# EAGLE design 808 (EAGLE 6.4)
DATABASE: ../partsdb.txt
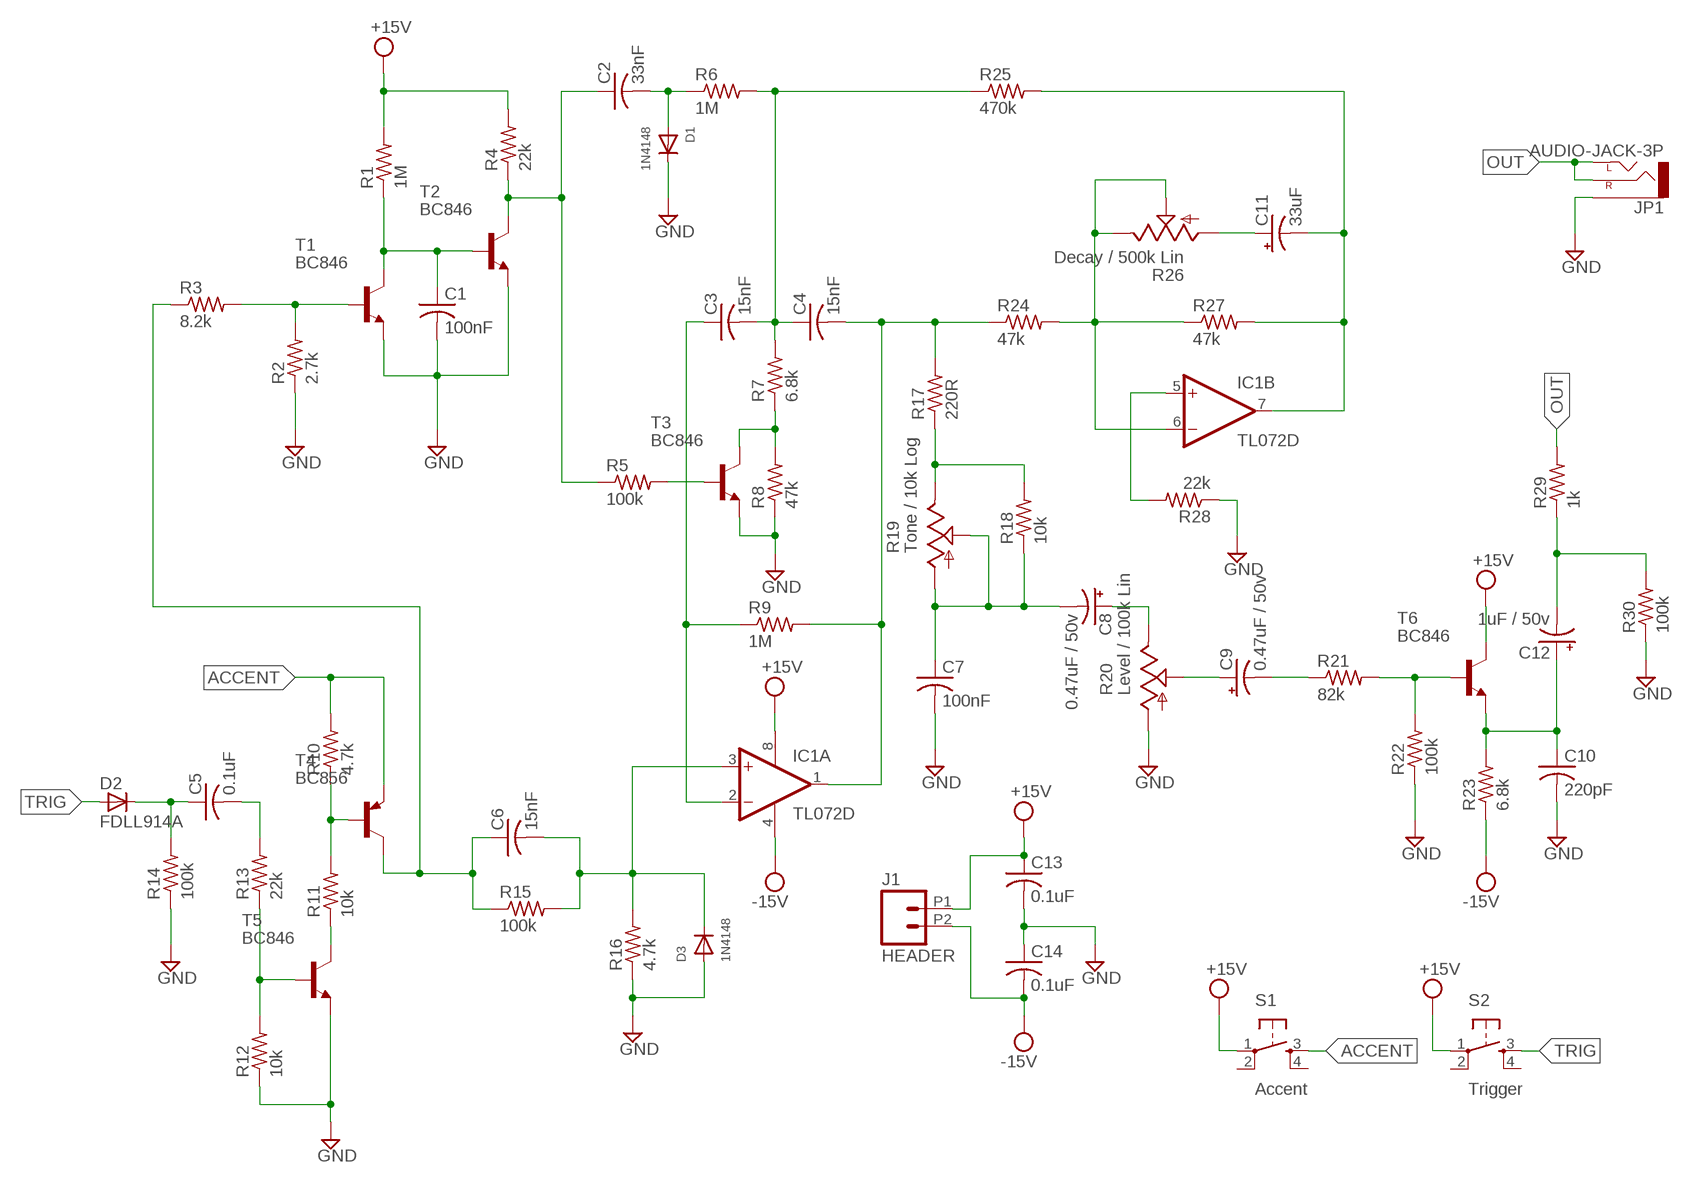
[diagram p0: schematic, sheet 1]

## Parts
C1  100nF  C-USC0805  [C0805]
C2  33nF  C-USC0805  [C0805]
C3  15nF  C-USC0805  [C0805]
C4  15nF  C-USC0805  [C0805]
C5  0.1uF  C-USC0805  [C0805]
C6  15nF  C-USC0805  [C0805]
C7  100nF  C-USC0805  [C0805]
C8  0.47uF / 50v  CAP-POLPANASONIC_B-2  [PANASONIC_VS_B-2]
C9  0.47uF / 50v  CAP-POLPANASONIC_B-2  [PANASONIC_VS_B-2]
C10  220pF  C-USC0805  [C0805]
C11  33uF  CAP-POLPANASONIC_B-2  [PANASONIC_VS_B-2]
C12  1uF / 50v  CAP-POLPANASONIC_B-2  [PANASONIC_VS_B-2]
C13  0.1uF  C-USC0805  [C0805]
C14  0.1uF  C-USC0805  [C0805]
D1  1N4148  DIODESOD-323F  [SOD-323F]
D2  FDLL914A  D-MLL-34  [MELF-MLL34]
D3  1N4148  DIODESOD-323F  [SOD-323F]
IC1  TL072D  [SO08]
J1  HEADER  [1X02-5.08-SCREWTERM]
JP1  AUDIO-JACK-3P  [CUI-352X-SMT]
R1  1M  R-US_R0805  [R0805]
R2  2.7k  R-US_R0805  [R0805]
R3  8.2k  R-US_R0805  [R0805]
R4  22k  R-US_R0805  [R0805]
R5  100k  R-US_R0805  [R0805]
R6  1M  R-US_R0805  [R0805]
R7  6.8k  R-US_R0805  [R0805]
R8  47k  R-US_R0805  [R0805]
R9  1M  R-US_R0805  [R0805]
R10  4.7k  R-US_R0805  [R0805]
R11  10k  R-US_R0805  [R0805]
R12  10k  R-US_R0805  [R0805]
R13  22k  R-US_R0805  [R0805]
R14  100k  R-US_R0805  [R0805]
R15  100k  R-US_R0805  [R0805]
R16  4.7k  R-US_R0805  [R0805]
R17  220R  R-US_R0805  [R0805]
R18  10k  R-US_R0805  [R0805]
R19  Tone / 10k Log  POTPTV09-H  [POTENTIOMETER-PTV09]
R20  Level / 100k Lin  POTCTS296  [POTENTIOMETER-CTS296]
R21  82k  R-US_R0805  [R0805]
R22  100k  R-US_R0805  [R0805]
R23  6.8k  R-US_R0805  [R0805]
R24  47k  R-US_R0805  [R0805]
R25  470k  R-US_R0805  [R0805]
R26  Decay / 500k Lin  POTPTV09-H  [POTENTIOMETER-PTV09]
R27  47k  R-US_R0805  [R0805]
R28  22k  R-US_R0805  [R0805]
R29  1k  R-US_R0805  [R0805]
R30  100k  R-US_R0805  [R0805]
S1  Accent  TAC_SWITCHSMD  [TACTILE-SWITCH-SMD]
S2  Trigger  TAC_SWITCHSMD  [TACTILE-SWITCH-SMD]
T1  BC846  [SOT23]
T2  BC846  [SOT23]
T3  BC846  [SOT23]
T4  BC856  BC856B-PNP-SOT23-BEC  [SOT23-BEC]
T5  BC846  [SOT23]
T6  BC846  [SOT23]

## Nets
+15V: C13.1 IC1.8(P:V+) J1.P1 R1.2 R4.2 S1.1 S2.1 T6.3(C)
-15V: C14.2 IC1.4(P:V-) J1.P2 R23.1
ACCENT: R10.2 S1.3 T4.E
GND: C1.2 C7.2 C10.2 C13.2 C14.1 D1.C D3.A JP1.1(SLEEVE) R2.1 R8.1 R12.1 R14.1 R16.1 R20.P$1(A) R22.1 R28.1 R30.1 T1.2(E) T2.2(E) T3.2(E) T5.2(E)
N$1: C1.1 R1.1 T1.3(C) T2.1(B)
N$2: C3.1 IC1.2(A:-IN) R9.1
N$3: C2.1 R4.1 R5.1 T2.3(C)
N$4: R2.2 R3.2 T1.1(B)
N$5: C2.2 D1.A R6.1
N$6: R5.2 T3.1(B)
N$7: R7.1 R8.2 T3.3(C)
N$8: C4.2 IC1.1(A:OUT) R9.2 R17.2 R24.1
N$9: C3.2 C4.1 R6.2 R7.2 R25.1
N$10: C6.1 R3.1 R15.1 T4.C
N$11: R11.1 T5.3(C)
N$12: R10.1 R11.2 T4.B
N$13: R12.2 R13.1 T5.1(B)
N$14: C5.2 R13.2
N$15: C5.1 D2.1(C) R14.2
N$16: C6.2 D3.C IC1.3(A:+IN) R15.2 R16.2
N$17: R17.1 R18.2 R19.P$3(E)
N$18: C7.1 C8.- R18.1 R19.P$1(A) R19.P$2(S)
N$19: IC1.6(B:-IN) R24.2 R26.P$2(S) R26.P$3(E) R27.1
N$20: C8.+ R20.P$3(E)
N$21: C9.+ R20.P$2(S)
N$22: C9.- R21.1
N$23: R21.2 R22.2 T6.1(B)
N$24: C10.1 C12.+ R23.2 T6.2(E)
N$25: IC1.5(B:+IN) R28.2
N$26: C11.- IC1.7(B:OUT) R25.2 R27.2
N$27: C11.+ R26.P$1(A)
N$28: C12.- R29.1 R30.2
OUT: JP1.2(LEFT) JP1.3(RIGHT) R29.2
TRIG: D2.2(A) S2.3
Unconnected: S1.2 S1.4 S2.2 S2.4

## Library data of the parts
C1 C5 C7 C13 C14 = adafruit:C-US: CAPACITOR, American symbol; PARTNO: C0805C104K5RACTU
C2 = adafruit:C-US: CAPACITOR, American symbol; PARTNO: CL21B333KBANNNC
C3 C4 C6 = adafruit:C-US: CAPACITOR, American symbol; PARTNO: CC0805KRX7R9BB153
C8 C9 = Livestream:CAP-POL; PARTNO: EEE-1HAR47AR
C10 = adafruit:C-US: CAPACITOR, American symbol; PARTNO: CC0805KRX7R9BB221
C11 = Livestream:CAP-POL; PARTNO: EEE-1AA330WAR
C12 = Livestream:CAP-POL; PARTNO: EEE-1HA010SR
D1 D3 = adafruit:DIODE: Diode SMADIODE - SMA Surface Mount Package 20V 1A Schottky Diode Digikey: 641-1014-6-ND DO-1N4148 - Through Hole Small Current Diode SOD-123 20V 1 A (.5mV Vf) Schottky Diode - Digikey: MBRX120TPMSCT-ND SOD-323 10V 570mA (.38mV Vf, 3ns) Schottky Diode - Digikey: ZLLS410CT-ND SOD-523 30V 30mA Schottky Diode (RB751S-40TE61) - Digikey: RB751S-40TE61CT-ND SOT23-R/W - SOT23 Package (R = Solder Paste/Reflow Ovens, W = Hand-Soldering) BAT54Film 40V 300mA - Digikey: 497-7162-1-ND; PARTNO: 1N4148WS
D2 = semicon-smd-ipc:D-: DIODE unfilled; PARTNO: FDLL914A
IC1 = linear:TL072: OP AMP; PARTNO: TL072SG-13
J1 = Livestream:HEADER
JP1 = Livestream:AUDIO-JACK-3P; PARTNO: SJ-3523-SMT-TR
R1 R6 R9 = adafruit:R-US_: RESISTOR, American symbol; PARTNO: RC2012F105CS
R2 = adafruit:R-US_: RESISTOR, American symbol; PARTNO: RMCF0805JT2K70
R3 = adafruit:R-US_: RESISTOR, American symbol; PARTNO: RMCF0805JT8K20
R4 R13 R28 = adafruit:R-US_: RESISTOR, American symbol; PARTNO: RMCF0805JT22K0
R5 R14 R15 R22 R30 = adafruit:R-US_: RESISTOR, American symbol; PARTNO: RC2012J104CS
R7 R23 = adafruit:R-US_: RESISTOR, American symbol; PARTNO: MCR10ERTF6801
R8 R24 R27 = adafruit:R-US_: RESISTOR, American symbol; PARTNO: RMCF0805JT47K0
R10 R16 = adafruit:R-US_: RESISTOR, American symbol; PARTNO: RMCF0805JT4K70
R11 R12 R18 = adafruit:R-US_: RESISTOR, American symbol; PARTNO: RC2012J103CS
R17 = adafruit:R-US_: RESISTOR, American symbol; PARTNO: RMCF0805JT220R
R19 = 808:POT; PARTNO: PTV09A-4020F-A103
R20 = 808:POT; PARTNO: 296UD104B1N
R21 = adafruit:R-US_: RESISTOR, American symbol; PARTNO: RMCF0805JT82K0
R25 = adafruit:R-US_: RESISTOR, American symbol; PARTNO: RMCF0805JT470K
R26 = 808:POT; PARTNO: 296UD504B1N
R29 = adafruit:R-US_: RESISTOR, American symbol; PARTNO: RC2012J102CS
S1 S2 = SparkFun-Electromechanical:TAC_SWITCH: Momentary Switch Button commonly used for reset or general input. Spark Fun Electronics SKU : COM-00097 SMT- SWCH-08247; PARTNO: PTS525SM10SMTR LFS
T1-T3 T5 T6 = transistor-neu-to92:BC846: NPN TRANSISTOR; PARTNO: BC846BMTF
T4 = transistor:*-PNP-: PNP Transistror; PARTNO: BC856BMTF

## Net classes
0 default: width 0.152 mm, drill 0.33 mm, clearance 0.152 mm

## Board
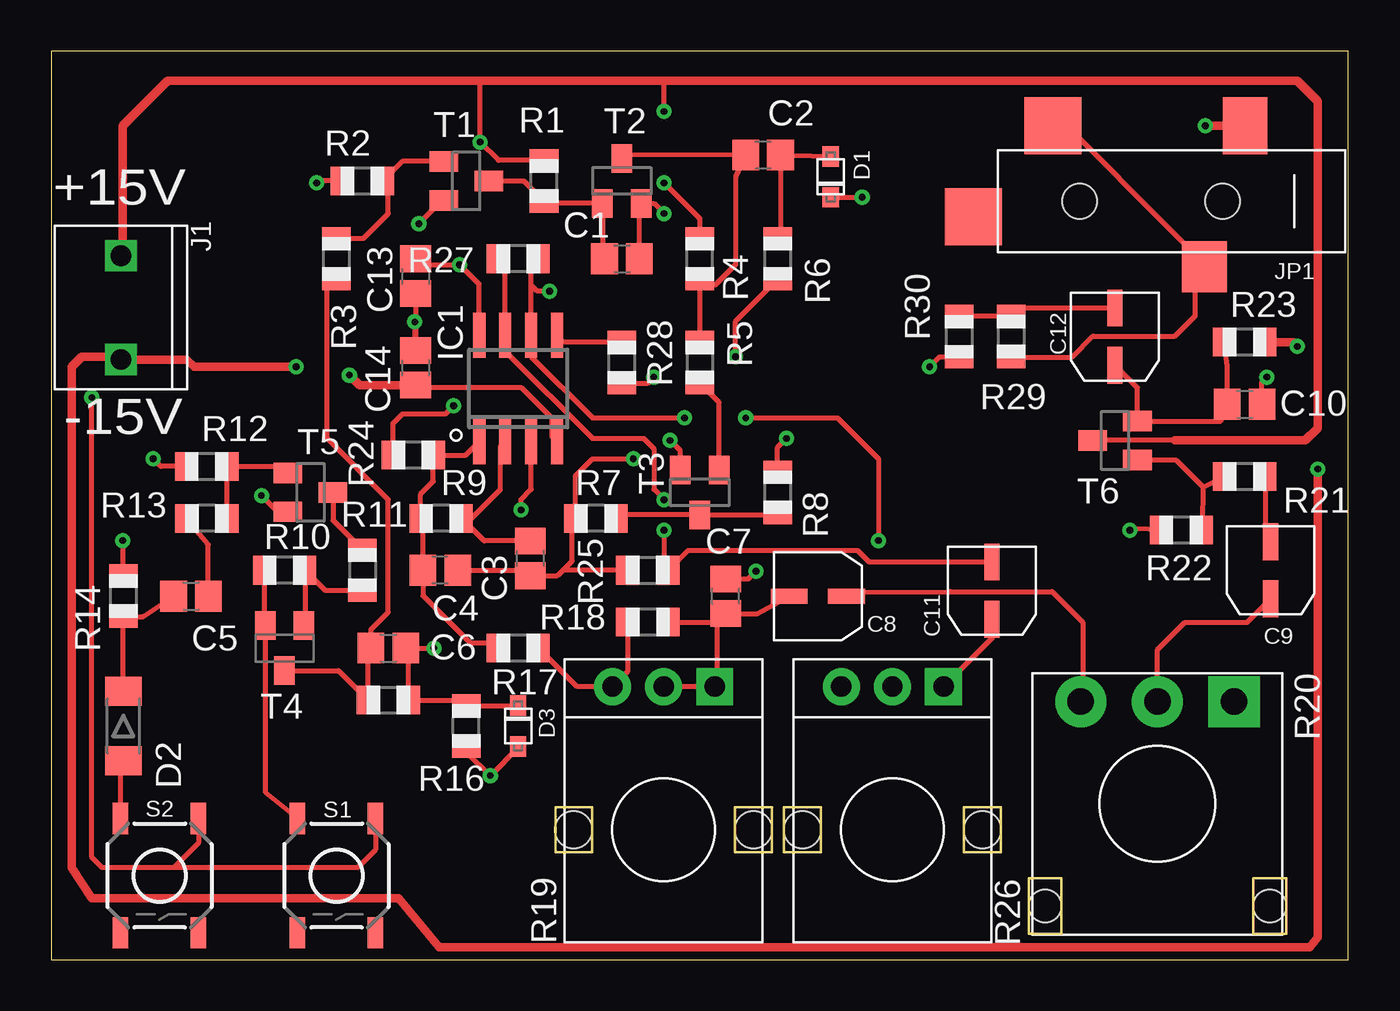
[diagram p1: board, top side]
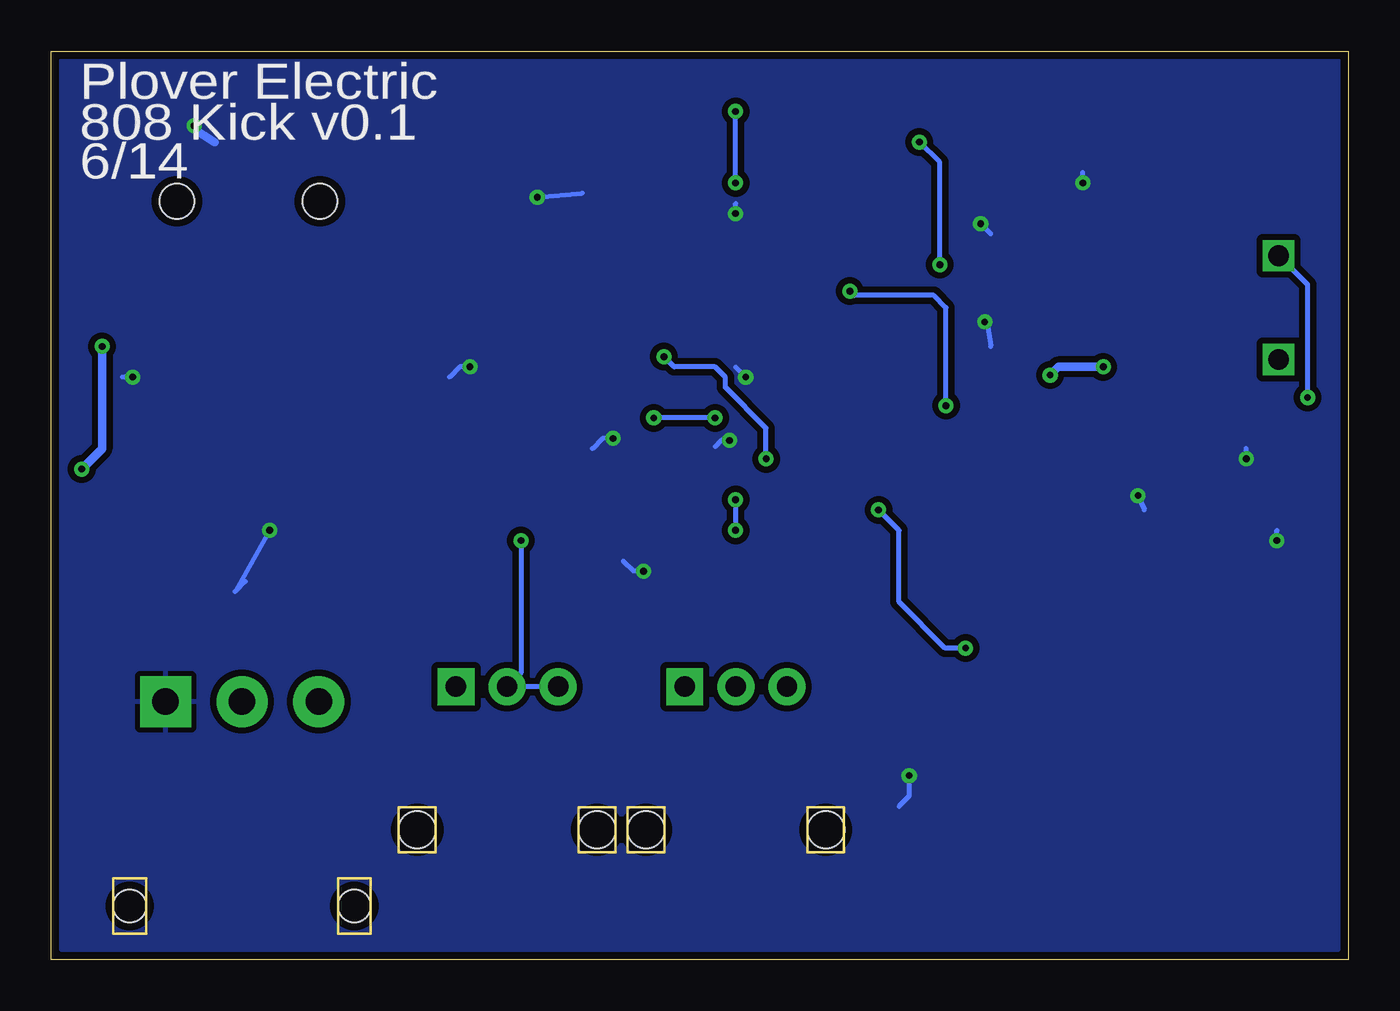
[diagram p2: board, bottom side, seen from below]

Size 63.5 x 44.45 mm. Coordinates in mm from the lower left corner, seen from the top.
Outline: 0,0 63.5,0 63.5,44.45 0,44.45 0,0
Copper layers (1*16): Top 0.035mm / dielectric 1.5mm / Bottom 0.035mm
Design rules "default *": minimum track width 6mil, minimum drill 13mil, track to track 6mil, track to pad 6mil, pad to pad 6mil, via to via 6mil, smd to smd 6mil, copper to edge 15mil, drill to drill 13mil, minimum pad ring 10mil, minimum via ring 8mil, stop-mask expansion 4mil, vias tented up to drill 16mil, thermal gap 10mil

### Footprints (pad centres in the part's own frame; a part is rotated, then mirrored left to right if it is on the bottom)
C0805 = smd 1.3 x 1.5: 1 -0.85,0; 2 0.85,0
PANASONIC_VS_B-2 = smd 0.75 x 1.8: + 0,-1.4; - 0,1.4
SOD-323F = smd 1 x 0.8: A -1,0; C 1,0
MELF-MLL34 = smd 1.4 x 1.8: 1 -1.7,0; 2 1.7,0
SO08 = smd 0.6 x 2.2: 1 -1.905,-2.6; 2 -0.635,-2.6; 3 0.635,-2.6; 4 1.905,-2.6; 5 1.905,2.6; 6 0.635,2.6; 7 -0.635,2.6; 8 -1.905,2.6
1X02-5.08-SCREWTERM = drill 1.016 square: P1 -2.54,0; P2 2.54,0
CUI-352X-SMT = smd 2.2 x 2.8: 1 -4.6,-3.7 | smd 2.8 x 2.8: 2 4.8,-3.7; 4 8.7,0.75 | smd 2.2 x 2.5: 3 -2.6,3.2 | hole 1.7: -3.5,0; 3.5,0
R0805 = smd 1.1 x 1.4: 1 -1,0; 2 1,0
POTENTIOMETER-PTV09 = drill 1 pad 1.8 square: P$1 -2.5,-7 | drill 1 pad 1.8: P$2 0,-7; P$3 2.5,-7 | hole 1.8: -4.4,0; 4.4,0
POTENTIOMETER-CTS296 = drill 1.3 pad 2.5 square: P$1 -3.75,-5 | drill 1.3 pad 2.5: P$2 0,-5; P$3 3.75,-5 | hole 1.6: -5.5,5; 5.5,5
TACTILE-SWITCH-SMD = smd 1.524 x 0.762: 1 -2.794,1.905; 2 2.794,1.905; 3 -2.794,-1.905; 4 2.794,-1.905
SOT23 = smd 1 x 1.4: 1 -0.95,-1.1; 2 0.95,-1.1; 3 0,1.1
SOT23-BEC = smd 1 x 1.4: B -0.95,-1.1; C 0,1.1; E 0.95,-1.1

### Placement (x,y rotation side)
C1  27.94,34.29 0 top
C2  34.85,39.37 0 top
C3  23.45,19.63 270 top
C4  19.05,19.05 180 top
C5  6.85,17.78 0 top
C6  16.51,15.24 0 top
C7  33.02,17.78 90 top
C8  37.53,17.78 90 top
C9  59.69,19.05 0 top
C10  58.42,27.17 0 top
C11  46.05,18.05 0 top
C12  52.07,30.48 0 top
C13  17.84,33.44 270 top
C14  17.84,28.96 270 top
D1  38.16,38.3 270 top
D2  3.54,11.43 270 top
D3  22.86,11.43 90 top
IC1  22.86,27.94 0 top
J1  3.42,31.9 270 top
JP1  53.84,37.1 180 top
R1  24.13,38.1 90 top
R2  15.24,38.1 0 top
R3  13.97,34.29 90 top
R4  31.75,34.29 90 top
R5  31.75,29.21 270 top
R6  35.56,34.29 270 top
R7  26.67,21.59 180 top
R8  35.56,22.86 270 top
R9  19.09,21.59 180 top
R10  11.43,19.05 180 top
R11  15.24,19.05 270 top
R12  7.62,24.13 0 top
R13  7.62,21.59 180 top
R14  3.54,17.78 270 top
R15  16.51,12.7 0 top
R16  20.32,11.43 90 top
R17  22.86,15.24 180 top
R18  29.21,16.51 180 top
R19  29.98,6.35 180 top
R20  54.15,7.62 180 top
R21  58.42,23.63 180 top
R22  55.32,21.02 0 top
R23  58.42,30.21 180 top
R24  17.73,24.68 180 top
R25  29.21,19.05 0 top
R26  41.18,6.35 180 top
R27  22.86,34.29 180 top
R28  27.94,29.21 90 top
R29  46.99,30.48 270 top
R30  44.45,30.48 90 top
S1  13.97,4.11 270 top
S2  5.31,4.11 270 top
T1  20.32,38.1 270 top
T2  27.94,38.1 0 top
T3  31.75,22.86 180 top
T4  11.43,15.24 180 top
T5  12.7,22.86 270 top
T6  52.07,25.4 90 top

### Tracks (layer width: path | path; a pad name or v marks a point on that pad's centre or on a via)
+15V  (via drill 0.33)
  Top 0.254: 55,25.4 T6.3 | IC1.8 20.95,33.05 v20,34 18.19,33.99 C13.1 | 21,43 v21,40 21.9,39.1 R1.2 | R4.2 31.75,36.25 v30,38 | v30,41.5 30,43 | S2.1 7.21,5.71 6,4.5 | 6,4.5 2.5,4.5 2,5 v2,27.5 | S1.1 15.88,5.38 15,4.5 6,4.5
  Top 0.406: 55,25.4 61.4,25.4 62,26 62,42 61,43 30,43 21,43 5.7,43 3.5,40.8 3.5,34.52 J1.P1
  Bottom 0.254: v20,34 20,39 v21,40 | v30,38 v30,41.5 | v2,27.5 2,33.02 J1.P1
-15V  (via drill 0.33)
  Top 0.254: IC1.4 24.5,25.61 24.5,26.5 23,28 17.95,28 C14.2
  Top 0.406: R23.1 60.79,30.21 v61,30 | v62,24 62,1.1 61.6,0.6 19,0.6 17,3 2,3 1,4.5 1,29 1.5,29.5 3.28,29.5 J1.P2 6.64,29.36 7,29 v12,29 | C14.2 15.09,28.11 v14.6,28.6
  Bottom 0.406: v61,30 61,25 v62,24 | v12,29 14.2,29 v14.6,28.6
ACCENT
  Top 0.254: R10.2 10.43,16.39 T4.E 10.48,8.19 S1.3
GND  (via drill 0.33)
  Top 0.254: R14.1 3.54,20.46 v3.5,20.5 | R12.1 5.37,24.13 v5,24.5 | T5.2 11.09,21.91 v10.3,22.7 | R2.1 13.1,38.1 v13,38 | T1.2 19.15,37.15 v18,36 | D1.C v39.7,37.3 | v30,36.5 29.5,37 T2.2 28.79,36.9 C1.2 | R28.1 29.21,28.21 v29.5,28.5 | D3.A 22.86,10.36 v21.5,9 20.32,10.18 R16.1 | C7.2 34.13,18.63 v34.5,19 | R8.1 35.56,25.06 v36,25.5 | R22.1 53.08,21.08 v52.8,21 | R30.1 43.48,29.48 v43,29 | C10.2 59.27,28.27 v59.5,28.5 | T3.2 30.8,24.9 v30.3,25.4 | C14.1 17.84,29.76 v17.8,31.2 17.84,29.84 C13.2
  Top 0.406: JP1.1 v56.5,40.8
  Bottom 0.254: v3.5,20.5 3.5,21 | v5,24.5 5,25 | v10.3,22.7 10,22 | v13,38 13,38.5 | v18,36 17.5,35.5 | v39.7,37.3 37.5,37.5 | v30,36.5 30,37 | v29.5,28.5 30,29 | v21.5,9 21.5,8 22,7.5 | v34.5,19 35,19 35.5,19.5 | v36,25.5 36.5,25.5 37,25 | v52.8,21 54.5,18 54,18.5 | v43,29 43.5,29 44,28.5 | v59.5,28.5 60,28.5 | v30.3,25.4 30.7,25.4 31,25.1 | v17.8,31.2 17.7,31.2 17.5,30
  Bottom 0.406: v56.5,40.8 56.3,40.5 55.5,40
  pour Bottom (isolate 0.305): 0.5,44 63,44 63,0.5 0.5,0.5
N$1
  Top 0.254: T1.3 23.13,38.1 R1.1 24.23,37 T2.1 26.99,34.39 C1.1
N$2
  Top 0.254: IC1.2 22,25.11 22,23 20.59,21.59 R9.1 21.2,20.48 C3.1
N$3
  Top 0.254: T2.3 27.93,39.4 C2.1 33.5,38.3 33.5,34 32.5,33 32.04,33 R4.1 R5.1
N$4
  Top 0.254: R3.2 15.29,35.29 16.5,36.5 16.5,37.84 R2.2 17.19,39.05 T1.1
N$5
  Top 0.254: D1.A 35.29,39.37 C2.2 35.7,35.55 R6.1
N$6
  Top 0.254: T3.1 32.7,27.26 R5.2
N$7
  Top 0.254: R7.1 27.84,21.76 T3.3 35.46,21.76 R8.2
N$8
  Top 0.254: 20.93,25.36 IC1.1 20.3,24.68 R24.1 18.7,24.65 18.7,23.4 18.09,22.79 R9.2 18.2,21.48 C4.2 18.2,17.8 20.5,15.5 21.6,15.5 R17.2
N$9  (via drill 0.33)
  Top 0.254: 25.05,19.05 25.5,19.5 25.5,21.42 R7.2 25.67,23.67 26.5,24.5 v28.5,24.5 | R25.1 25.05,19.05 | 25.05,19.05 24.78,18.78 C3.2 23.18,19.05 C4.1 | v33.5,29.5 33.5,31.23 R6.2
  Bottom 0.254: v28.5,24.5 28.5,26 30.5,28 30.5,28.5 31,29 33,29 v33.5,29.5
N$10
  Top 0.254: T4.C 14.07,14.14 R15.1 15.51,15.09 C6.1 15.66,16.16 16.5,17 16.5,22.5 13.5,25.5 13.5,32.82 R3.1
N$11
  Top 0.254: T5.3 13.8,21.49 R11.1
N$12
  Top 0.254: R11.2 13.43,18.05 R10.1 12.43,16.39 T4.B
N$13
  Top 0.254: R13.1 R12.2 11.28,24.13 T5.1
N$14
  Top 0.254: C5.2 7.7,20.31 R13.2
N$15
  Top 0.254: D2.1 R14.2 4.5,16.78 C5.1
N$16  (via drill 0.33)
  Top 0.254: D3.C R16.2 20.05,12.7 R15.2 17.51,15.09 C6.2 v18.74,15.24 | IC1.3 23.5,23 23,22.5 v23,22
  Bottom 0.254: v18.74,15.24 19.74,15.24 22,17.5 22,21 v23,22
N$17
  Top 0.254: R18.2 28.21,14.08 R19.P$3 25.75,13.35 R17.1
N$18
  Top 0.254: R18.1 32.6,16.51 | 32.6,16.51 C7.1 34.58,16.93 C8.- | 32.6,16.51 32.6,13.47 R19.P$1 R19.P$2
N$19  (via drill 0.33)
  Top 0.254: 23.5,33 IC1.6 23.5,29.5 26.5,26.5 v31,26.5 | 23.5,33 23.5,33.92 R27.1 24,34.43 | v34,26.5 38.5,26.5 40.5,24.5 v40.5,20.5 | R24.2 16.73,26.23 17.2,26.7 19.3,26.7 v19.7,27.1 | v24.4,32.7 23.8,32.7 23.5,33
  Bottom 0.254: v31,26.5 v34,26.5 | v40.5,20.5 40.5,14.03 R26.P$2 R26.P$3 | v19.7,27.1 19.7,31.9 20.3,32.5 24.2,32.5 v24.4,32.7
N$20
  Top 0.254: C8.+ 39.58,17.98 44,18 49,18 50.5,16.5 50.5,12.72 R20.P$3
N$21
  Top 0.254: R20.P$2 54.15,15.15 55.5,16.5 58.54,16.5 C9.+
N$22
  Top 0.254: R21.1 59.42,20.72 C9.-
N$23
  Top 0.254: R22.2 56.38,21.29 56.4,23.11 | 56.4,23.11 R21.2 | T6.1 55.05,24.45 56.4,23.11
N$24
  Top 0.254: R23.2 57.57,29.06 C10.1 57.25,26.35 T6.2 53.17,27.98 C12.+
N$25
  Top 0.254: R28.2 25.09,30.21 IC1.5
N$26  (via drill 0.33)
  Top 0.254: R27.2 22.23,33.92 IC1.7 22.23,29.77 26.5,25.5 29,25.5 29.5,25 29.5,23 v30,22.5 | C11.- 40.05,19.45 39.5,20 31.16,20 R25.2 30,19.26 v30,21
  Bottom 0.254: v30,22.5 v30,21
N$27
  Top 0.254: C11.+ 46.05,15.72 R26.P$1
N$28
  Top 0.254: C12.- 47.39,31.88 R29.1 R30.2
OUT
  Top 0.254: R29.2 49.98,29.48 51,30.5 55,30.5 56,31.5 56,34.84 JP1.3 55.6,34.9 49,41.5 48.84,41.5 JP1.2
TRIG
  Top 0.254: S2.3 3.4,9.1 D2.2

### Text on the board
tPlace: +15V | -15V
bPlace: Plover Electric | 808 Kick v0.1 | 6/14